# Altium schematic sheet IcanStudioLive Controller.SchDoc
size A4
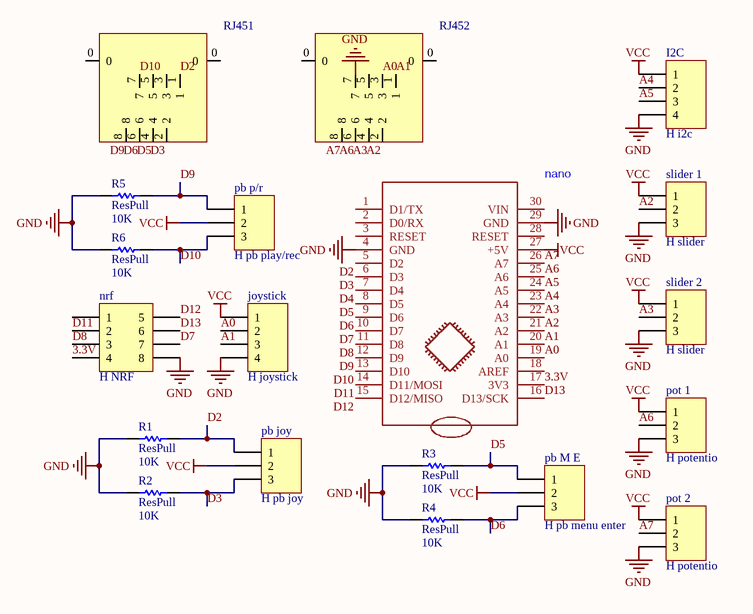
[diagram p0: IcanStudioLive Controller.SchDoc]

## Parts
I2C  H i2c  [HDR1X4]
joystick  H joystick  [HDR1X4]
nano  (no value)  [PCBComponent_1]
nrf  H NRF  [HDR2X4_CEN]
pb_joy  H pb joy  [HDR1X3]
pb_M_E  H pb menu enter  [HDR1X3]
pb_p/r  H pb play/rec  [HDR1X3]
pot_1  H potentio  [HDR1X3]
pot_2  H potentio  [HDR1X3]
R1  ResPull  value 10K  [AXIAL-0.3]
R2  ResPull  value 10K  [AXIAL-0.3]
R3  ResPull  value 10K  [AXIAL-0.3]
R4  ResPull  value 10K  [AXIAL-0.3]
R5  ResPull  value 10K  [AXIAL-0.3]
R6  ResPull  value 10K  [AXIAL-0.3]
RJ451  RJ451  [PCBComponent_1]  (value not drawn)
RJ452  RJ452  [PCBComponent_1]  (value not drawn)
slider_1  H slider  [HDR1X3]
slider_2  H slider  [HDR1X3]

## Nets
GND: I2C.4 joystick.4 nano.4(GND) nano.29(GND) nrf.8 pot_1.3 pot_2.3 R1.1 R2.1 R3.1 R4.1 R5.1 R6.1 RJ452.7 slider_1.3 slider_2.3
VCC: I2C.1 joystick.1 nano.27(+5V) pb_joy.2 pb_M_E.2 pb_p/r.2 pot_1.1 pot_2.1 slider_1.1 slider_2.1
3.3V: nano.17(3V3) nrf.4
A0: joystick.2 nano.19(A0) RJ452.3
A1: joystick.3 nano.20(A1) RJ452.1
A2: nano.21(A2) RJ452.2 slider_1.2
A3: nano.22(A3) RJ452.4 slider_2.2
A4: I2C.2 nano.23(A4)
A5: I2C.3 nano.24(A5)
A6: nano.25(A6) pot_1.2 RJ452.6
A7: nano.26(A7) pot_2.2 RJ452.8
D2: nano.5(D2) pb_joy.1 R1.2 RJ451.1
D3: nano.6(D3) pb_joy.3 R2.2 RJ451.2
D4: nano.7(D4)
D5: nano.8(D5) pb_M_E.1 R3.2 RJ451.4
D6: nano.9(D6) pb_M_E.3 R4.2 RJ451.6
D7: nano.10(D7) nrf.7
D8: nano.11(D8) nrf.3
D9: nano.12(D9) pb_p/r.1 R5.2 RJ451.8
D10: nano.13(D10) pb_p/r.3 R6.2 RJ451.7
D11: nano.14(D11/MOSI) nrf.2
D12: nano.15(D12/MISO) nrf.5
D13: nano.16(D13/SCK) nrf.6

Not connected (* = marked no-connect by the designer): nano 1(D1/TX) 2(D0/RX) 3(RESET) 18(AREF) 28(RESET) 30(VIN); nrf 1; RJ451 0 3 5; RJ452 0 5

## Library data of the parts
I2C joystick = Header 4: Header, 4-Pin; LatestRevisionDate: 17-Jul-2002; LatestRevisionNote: Re-released for DXP Platform.; Publisher: Altium Limited
nano = ARDUINO_NANO
nrf = Header 4X2A: Header, 4-Pin, Dual row; LatestRevisionDate: 17-Jul-2002; LatestRevisionNote: Re-released for DXP Platform.; Publisher: Altium Limited
pb_joy pb_M_E pb_p/r pot_1 pot_2 slider_1 slider_2 = Header 3: Header, 3-Pin; LatestRevisionDate: 17-Jul-2002; LatestRevisionNote: Re-released for DXP Platform.; Publisher: Altium Limited
R1-R6 = Res1: Resistor; Published: 8-Jun-2000; LatestRevisionDate: 17-Jul-2002; LatestRevisionNote: Re-released for DXP Platform.; PackageReference: AXIAL-0.3; Publisher: Altium Limited; PackageDescription: Axial Device, Thru-Hole; 2 Leads; 0.3 in Pin Spacing
RJ451 RJ452 = Component_1